# EAGLE design RF08bck (EAGLE 6.6.0)

## Sheet 1 of 2
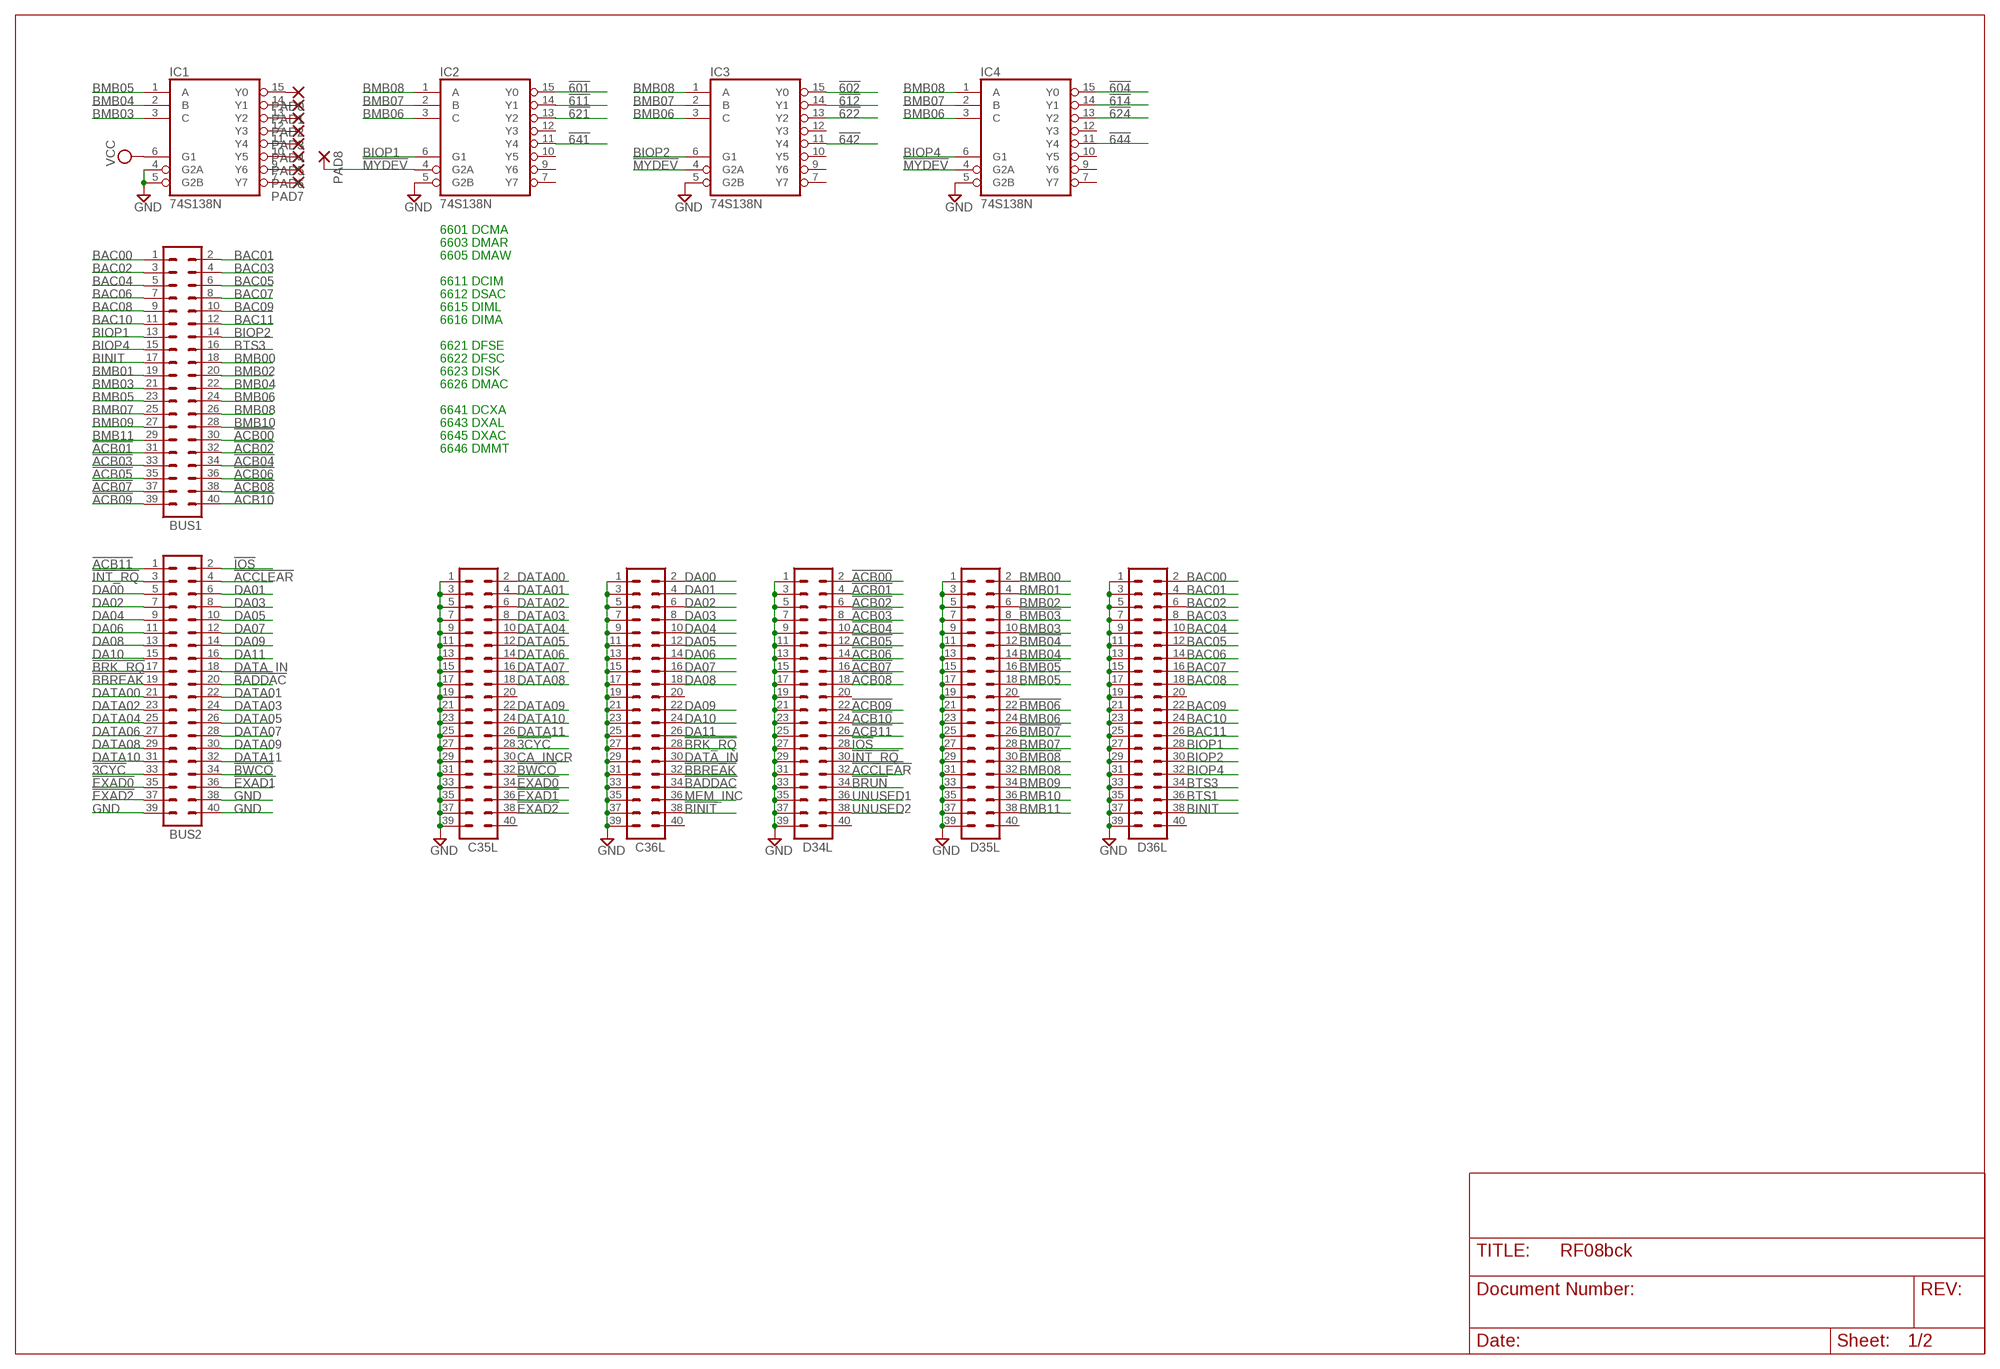
[diagram p0: schematic, sheet 1]

### Parts
BUS1  MA20-2  [MA20-2]
BUS2  MA20-2  [MA20-2]
C35L  MA20-2  [MA20-2]
C36L  MA20-2  [MA20-2]
D34L  MA20-2  [MA20-2]
D35L  MA20-2  [MA20-2]
D36L  MA20-2  [MA20-2]
IC1  74S138N  [DIL16]
IC2  74S138N  [DIL16]
IC3  74S138N  [DIL16]
IC4  74S138N  [DIL16]
PAD0  1,6/0,8  [1,6/0,8]
PAD1  1,6/0,8  [1,6/0,8]
PAD2  1,6/0,8  [1,6/0,8]
PAD3  1,6/0,8  [1,6/0,8]
PAD4  1,6/0,8  [1,6/0,8]
PAD5  1,6/0,8  [1,6/0,8]
PAD6  1,6/0,8  [1,6/0,8]
PAD7  1,6/0,8  [1,6/0,8]
PAD8  1,6/0,8  [1,6/0,8]

### Nets
!3CYC: BUS2.33 C35L.28
!601: IC2.15(Y0) ; also sheet 2
!602: IC3.15(Y0) ; also sheet 2
!604: IC4.15(Y0) ; also sheet 2
!611: IC2.14(Y1)
!612: IC3.14(Y1)
!614: IC4.14(Y1)
!621: IC2.13(Y2)
!622: IC3.13(Y2)
!624: IC4.13(Y2) ; also sheet 2
!641: IC2.11(Y4)
!642: IC3.11(Y4)
!644: IC4.11(Y4)
!ACB00: BUS1.30 D34L.2 ; also sheet 2
!ACB01: BUS1.31 D34L.4 ; also sheet 2
!ACB02: BUS1.32 D34L.6 ; also sheet 2
!ACB03: BUS1.33 D34L.8 ; also sheet 2
!ACB04: BUS1.34 D34L.10 ; also sheet 2
!ACB05: BUS1.35 D34L.12 ; also sheet 2
!ACB06: BUS1.36 D34L.14 ; also sheet 2
!ACB07: BUS1.37 D34L.16 ; also sheet 2
!ACB08: BUS1.38 D34L.18 ; also sheet 2
!ACB09: BUS1.39 D34L.22 ; also sheet 2
!ACB10: BUS1.40 D34L.24 ; also sheet 2
!ACB11: BUS2.1 D34L.26 ; also sheet 2
!ACCLEAR: BUS2.4 D34L.32
!BADDAC: BUS2.20 C36L.34
!BBREAK: BUS2.19 C36L.32
!BINIT: C36L.38
!BMB03: D35L.8
!BMB04: D35L.12
!BMB05: D35L.16
!BMB06: D35L.22
!BMB07: D35L.26
!BMB08: D35L.30
!BRK_RQ: BUS2.17 C36L.28
!BRUN: D34L.34
!BWCO: BUS2.34 C35L.32
!EXAD0: BUS2.35 C35L.34
!EXAD1: BUS2.36 C35L.36
!EXAD2: BUS2.37 C35L.38
!INT_RQ: BUS2.3 D34L.30
!IOS: BUS2.2 D34L.28
!MYDEV: IC2.4(G2A) IC3.4(G2A) IC4.4(G2A) PAD8.1(P)
BAC00: BUS1.1 D36L.2 ; also sheet 2
BAC01: BUS1.2 D36L.4 ; also sheet 2
BAC02: BUS1.3 D36L.6 ; also sheet 2
BAC03: BUS1.4 D36L.8 ; also sheet 2
BAC04: BUS1.5 D36L.10 ; also sheet 2
BAC05: BUS1.6 D36L.12 ; also sheet 2
BAC06: BUS1.7 D36L.14 ; also sheet 2
BAC07: BUS1.8 D36L.16 ; also sheet 2
BAC08: BUS1.9 D36L.18 ; also sheet 2
BAC09: BUS1.10 D36L.22 ; also sheet 2
BAC10: BUS1.11 D36L.24 ; also sheet 2
BAC11: BUS1.12 D36L.26 ; also sheet 2
BINIT: BUS1.17 D36L.38
BIOP1: BUS1.13 D36L.28 IC2.6(G1)
BIOP2: BUS1.14 D36L.30 IC3.6(G1)
BIOP4: BUS1.15 D36L.32 IC4.6(G1)
BMB00: BUS1.18 D35L.2
BMB01: BUS1.19 D35L.4
BMB02: BUS1.20 D35L.6
BMB03: BUS1.21 D35L.10 IC1.3(C)
BMB04: BUS1.22 D35L.14 IC1.2(B)
BMB05: BUS1.23 D35L.18 IC1.1(A)
BMB06: BUS1.24 D35L.24 IC2.3(C) IC3.3(C) IC4.3(C)
BMB07: BUS1.25 D35L.28 IC2.2(B) IC3.2(B) IC4.2(B)
BMB08: BUS1.26 D35L.32 IC2.1(A) IC3.1(A) IC4.1(A)
BMB09: BUS1.27 D35L.34
BMB10: BUS1.28 D35L.36
BMB11: BUS1.29 D35L.38
BTS1: D36L.36
BTS3: BUS1.16 D36L.34
CA_INCR: C35L.30
DA00: BUS2.5 C36L.2
DA01: BUS2.6 C36L.4
DA02: BUS2.7 C36L.6
DA03: BUS2.8 C36L.8
DA04: BUS2.9 C36L.10
DA05: BUS2.10 C36L.12
DA06: BUS2.11 C36L.14
DA07: BUS2.12 C36L.16
DA08: BUS2.13 C36L.18
DA09: BUS2.14 C36L.22
DA10: BUS2.15 C36L.24
DA11: BUS2.16 C36L.26
DATA00: BUS2.21 C35L.2
DATA01: BUS2.22 C35L.4
DATA02: BUS2.23 C35L.6
DATA03: BUS2.24 C35L.8
DATA04: BUS2.25 C35L.10
DATA05: BUS2.26 C35L.12
DATA06: BUS2.27 C35L.14
DATA07: BUS2.28 C35L.16
DATA08: BUS2.29 C35L.18
DATA09: BUS2.30 C35L.22
DATA10: BUS2.31 C35L.24
DATA11: BUS2.32 C35L.26
DATA_IN: BUS2.18 C36L.30
GND: BUS2.38 BUS2.39 BUS2.40 C35L.1 C35L.3 C35L.5 C35L.7 C35L.9 C35L.11 C35L.13 C35L.15 C35L.17 C35L.19 C35L.21 C35L.23 C35L.25 C35L.27 C35L.29 C35L.31 C35L.33 C35L.35 C35L.37 C35L.39 C36L.1 C36L.3 C36L.5 C36L.7 C36L.9 C36L.11 C36L.13 C36L.15 C36L.17 C36L.19 C36L.21 C36L.23 C36L.25 C36L.27 C36L.29 C36L.31 C36L.33 C36L.35 C36L.37 C36L.39 D34L.1 D34L.3 D34L.5 D34L.7 D34L.9 D34L.11 D34L.13 D34L.15 D34L.17 D34L.19 D34L.21 D34L.23 D34L.25 D34L.27 D34L.29 D34L.31 D34L.33 D34L.35 D34L.37 D34L.39 D35L.1 D35L.3 D35L.5 D35L.7 D35L.9 D35L.11 D35L.13 D35L.15 D35L.17 D35L.19 D35L.21 D35L.23 D35L.25 D35L.27 D35L.29 D35L.31 D35L.33 D35L.35 D35L.37 D35L.39 D36L.1 D36L.3 D36L.5 D36L.7 D36L.9 D36L.11 D36L.13 D36L.15 D36L.17 D36L.19 D36L.21 D36L.23 D36L.25 D36L.27 D36L.29 D36L.31 D36L.33 D36L.35 D36L.37 D36L.39 IC1.4(G2A) IC1.5(G2B) IC2.5(G2B) IC3.5(G2B) IC4.5(G2B) ; also sheet 2
MEM_INC: C36L.36
N$1: IC1.9(Y6) PAD6.1(P)
N$5: IC1.15(Y0) PAD0.1(P)
N$6: IC1.14(Y1) PAD1.1(P)
N$7: IC1.13(Y2) PAD2.1(P)
N$8: IC1.12(Y3) PAD3.1(P)
N$9: IC1.11(Y4) PAD4.1(P)
N$10: IC1.10(Y5) PAD5.1(P)
N$11: IC1.7(Y7) PAD7.1(P)
UNUSED1: D34L.36
UNUSED2: D34L.38
VCC: IC1.6(G1)
Unconnected: C35L.20 C35L.40 C36L.20 C36L.40 D34L.20 D34L.40 D35L.20 D35L.40 D36L.20 D36L.40 IC2.7(Y7) IC2.9(Y6) IC2.10(Y5) IC2.12(Y3) IC3.7(Y7) IC3.9(Y6) IC3.10(Y5) IC3.12(Y3) IC4.7(Y7) IC4.9(Y6) IC4.10(Y5) IC4.12(Y3)

### Notes on the sheet
- 6601 DCMA
- 6603 DMAR
- 6605 DMAW
- 6611 DCIM
- 6612 DSAC
- 6615 DIML
- 6616 DIMA
- 6621 DFSE
- 6622 DFSC
- 6623 DISK
- 6626 DMAC
- 6641 DCXA
- 6643 DXAL
- 6645 DXAC
- 6646 DMMT

## Sheet 2 of 2
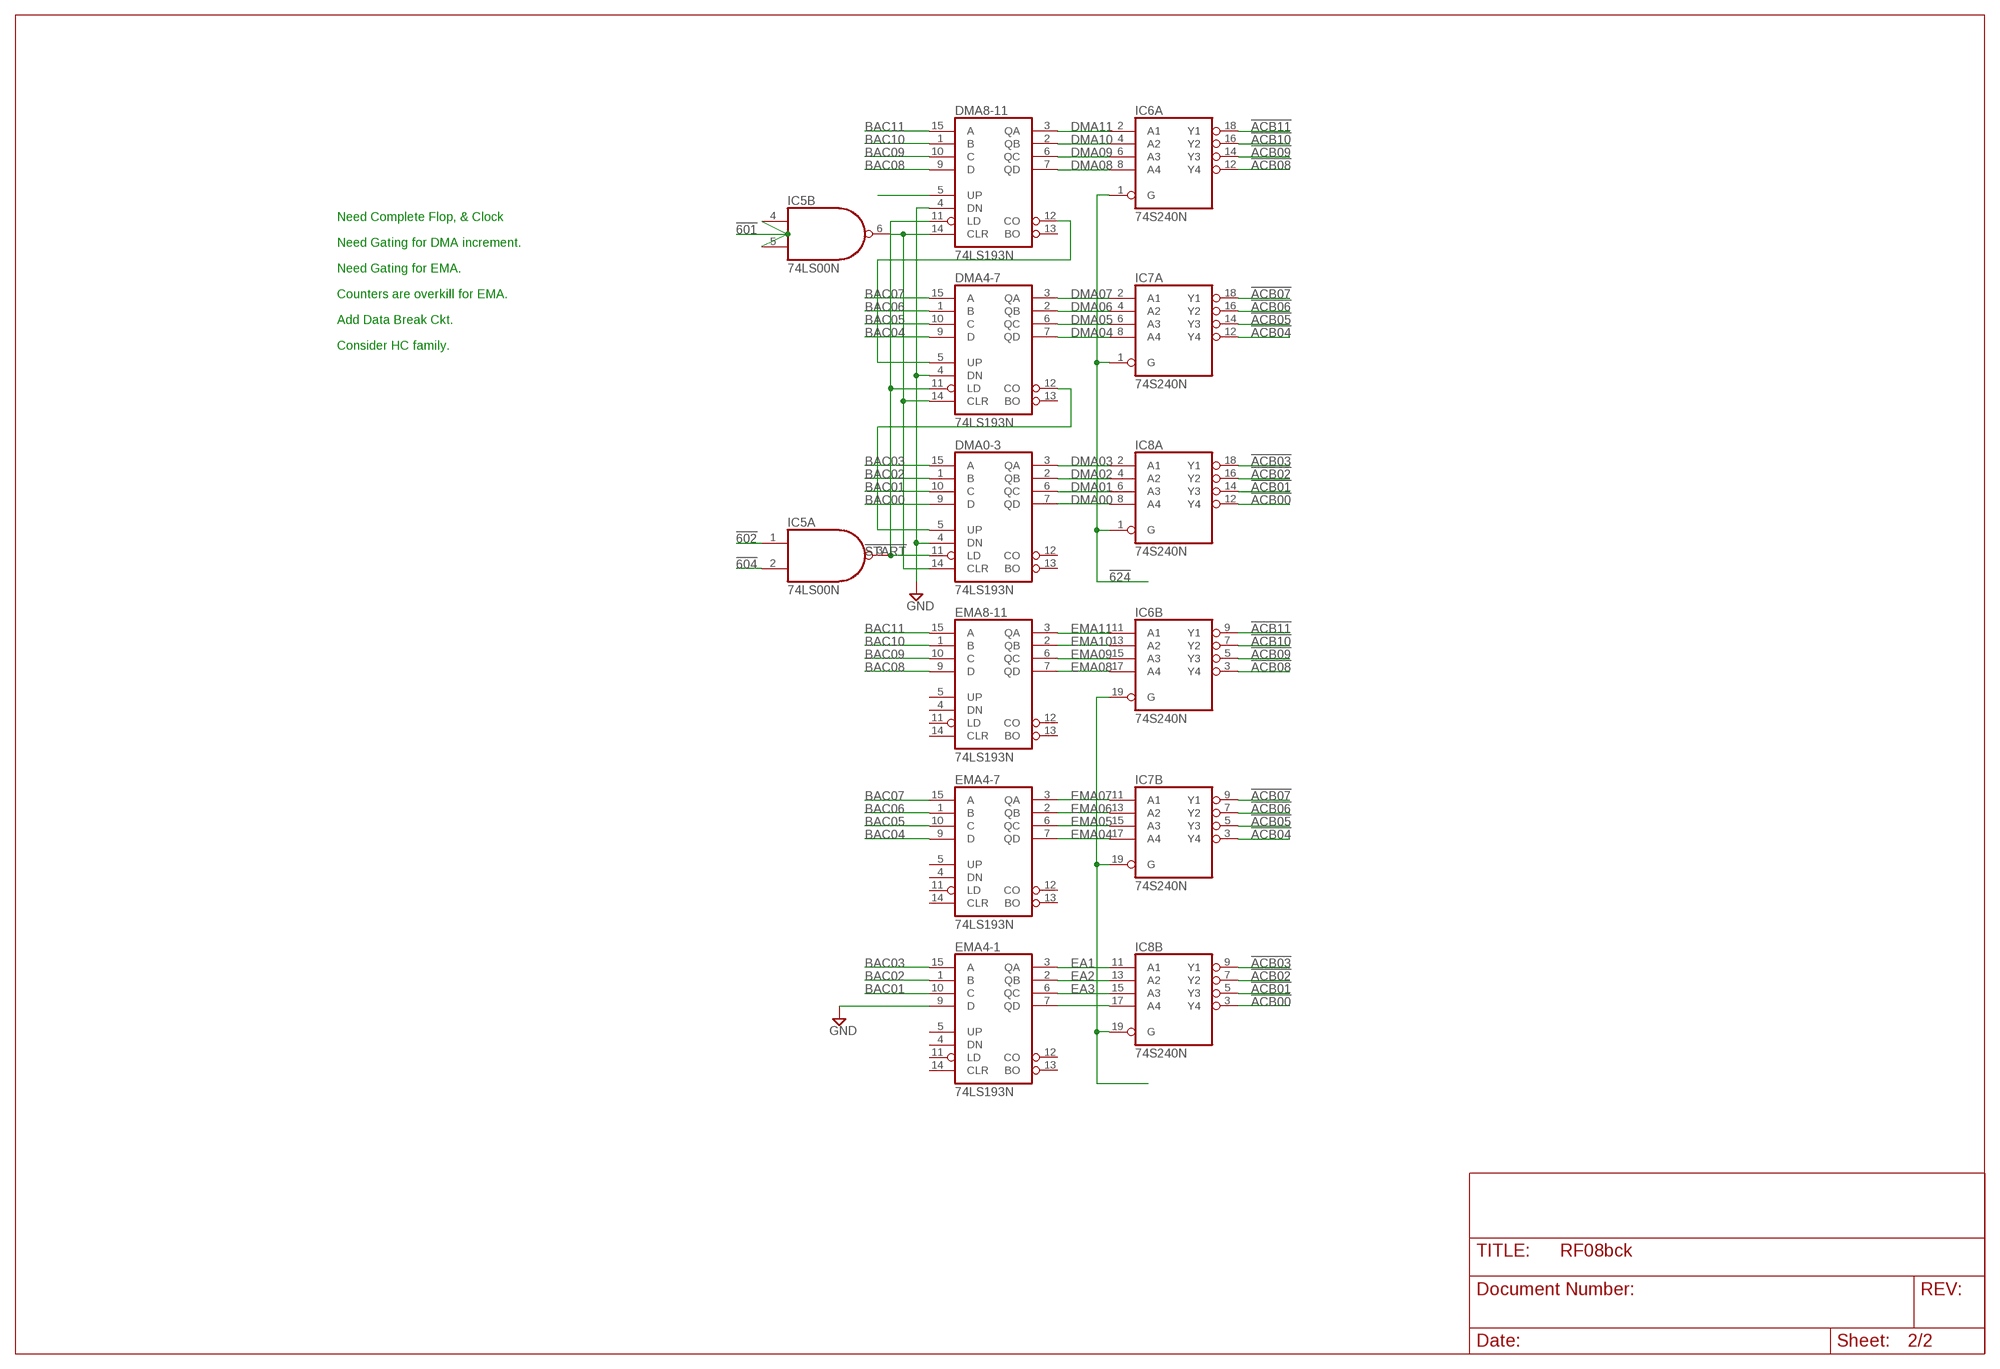
[diagram p1: schematic, sheet 2]

### Parts
DMA0-3  74LS193N  74LS192N  [DIL16]
DMA4-7  74LS193N  74LS192N  [DIL16]
DMA8-11  74LS193N  74LS192N  [DIL16]
EMA4-1  74LS193N  74LS192N  [DIL16]
EMA4-7  74LS193N  74LS192N  [DIL16]
EMA8-11  74LS193N  74LS192N  [DIL16]
IC5  74LS00N  [DIL14]
IC6  74S240N  [DIL20]
IC7  74S240N  [DIL20]
IC8  74S240N  [DIL20]

### Nets
!601: IC5.4(B:I0) IC5.5(B:I1) ; also sheet 1
!602: IC5.1(A:I0) ; also sheet 1
!604: IC5.2(A:I1) ; also sheet 1
!624: IC6.1(A:G) IC7.1(A:G) IC8.1(A:G) ; also sheet 1
!ACB00: IC8.3(B:Y4) IC8.12(A:Y4) ; also sheet 1
!ACB01: IC8.5(B:Y3) IC8.14(A:Y3) ; also sheet 1
!ACB02: IC8.7(B:Y2) IC8.16(A:Y2) ; also sheet 1
!ACB03: IC8.9(B:Y1) IC8.18(A:Y1) ; also sheet 1
!ACB04: IC7.3(B:Y4) IC7.12(A:Y4) ; also sheet 1
!ACB05: IC7.5(B:Y3) IC7.14(A:Y3) ; also sheet 1
!ACB06: IC7.7(B:Y2) IC7.16(A:Y2) ; also sheet 1
!ACB07: IC7.9(B:Y1) IC7.18(A:Y1) ; also sheet 1
!ACB08: IC6.3(B:Y4) IC6.12(A:Y4) ; also sheet 1
!ACB09: IC6.5(B:Y3) IC6.14(A:Y3) ; also sheet 1
!ACB10: IC6.7(B:Y2) IC6.16(A:Y2) ; also sheet 1
!ACB11: IC6.9(B:Y1) IC6.18(A:Y1) ; also sheet 1
!START: DMA0-3.11(LD) DMA4-7.11(LD) DMA8-11.11(LD) IC5.3(A:O)
BAC00: DMA0-3.9(D) ; also sheet 1
BAC01: DMA0-3.10(C) EMA4-1.10(C) ; also sheet 1
BAC02: DMA0-3.1(B) EMA4-1.1(B) ; also sheet 1
BAC03: DMA0-3.15(A) EMA4-1.15(A) ; also sheet 1
BAC04: DMA4-7.9(D) EMA4-7.9(D) ; also sheet 1
BAC05: DMA4-7.10(C) EMA4-7.10(C) ; also sheet 1
BAC06: DMA4-7.1(B) EMA4-7.1(B) ; also sheet 1
BAC07: DMA4-7.15(A) EMA4-7.15(A) ; also sheet 1
BAC08: DMA8-11.9(D) EMA8-11.9(D) ; also sheet 1
BAC09: DMA8-11.10(C) EMA8-11.10(C) ; also sheet 1
BAC10: DMA8-11.1(B) EMA8-11.1(B) ; also sheet 1
BAC11: DMA8-11.15(A) EMA8-11.15(A) ; also sheet 1
DMA00: DMA0-3.7(QD) IC8.8(A:A4)
DMA01: DMA0-3.6(QC) IC8.6(A:A3)
DMA02: DMA0-3.2(QB) IC8.4(A:A2)
DMA03: DMA0-3.3(QA) IC8.2(A:A1)
DMA04: DMA4-7.7(QD) IC7.8(A:A4)
DMA05: DMA4-7.6(QC) IC7.6(A:A3)
DMA06: DMA4-7.2(QB) IC7.4(A:A2)
DMA07: DMA4-7.3(QA) IC7.2(A:A1)
DMA08: DMA8-11.7(QD) IC6.8(A:A4)
DMA09: DMA8-11.6(QC) IC6.6(A:A3)
DMA10: DMA8-11.2(QB) IC6.4(A:A2)
DMA11: DMA8-11.3(QA) IC6.2(A:A1)
EA1: EMA4-1.3(QA) IC8.11(B:A1)
EA2: EMA4-1.2(QB) IC8.13(B:A2)
EA3: EMA4-1.6(QC) IC8.15(B:A3)
EMA04: EMA4-7.7(QD) IC7.17(B:A4)
EMA05: EMA4-7.6(QC) IC7.15(B:A3)
EMA06: EMA4-7.2(QB) IC7.13(B:A2)
EMA07: EMA4-7.3(QA) IC7.11(B:A1)
EMA08: EMA8-11.7(QD) IC6.17(B:A4)
EMA09: EMA8-11.6(QC) IC6.15(B:A3)
EMA10: EMA8-11.2(QB) IC6.13(B:A2)
EMA11: EMA8-11.3(QA) IC6.11(B:A1)
GND: DMA0-3.4(DN) DMA4-7.4(DN) DMA8-11.4(DN) EMA4-1.9(D) ; also sheet 1
N$3: DMA0-3.5(UP) DMA4-7.12(CO)
N$4: DMA8-11.5(UP)
N$12: EMA4-1.7(QD) IC8.17(B:A4)
N$13: DMA4-7.5(UP) DMA8-11.12(CO)
N$16: IC6.19(B:G) IC7.19(B:G) IC8.19(B:G)
N$22: DMA0-3.14(CLR) DMA4-7.14(CLR) DMA8-11.14(CLR) IC5.6(B:O)
Unconnected: DMA0-3.12(CO) DMA0-3.13(BO) DMA4-7.13(BO) DMA8-11.13(BO) EMA4-1.4(DN) EMA4-1.5(UP) EMA4-1.11(LD) EMA4-1.12(CO) EMA4-1.13(BO) EMA4-1.14(CLR) EMA4-7.4(DN) EMA4-7.5(UP) EMA4-7.11(LD) EMA4-7.12(CO) EMA4-7.13(BO) EMA4-7.14(CLR) EMA8-11.4(DN) EMA8-11.5(UP) EMA8-11.11(LD) EMA8-11.12(CO) EMA8-11.13(BO) EMA8-11.14(CLR) IC5.8(C:O) IC5.9(C:I0) IC5.10(C:I1) IC5.11(D:O) IC5.12(D:I0) IC5.13(D:I1)

### Notes on the sheet
- Need Complete Flop, & Clock
- Need Gating for DMA increment.
- Need Gating for EMA.
- Counters are overkill for EMA.
- Add Data Break Ckt.
- Consider HC family.

## Power pins joined to a net without a drawn wire
GND: DMA0-3.8(GND) DMA4-7.8(GND) DMA8-11.8(GND) EMA4-1.8(GND) EMA4-7.8(GND) EMA8-11.8(GND) IC1.8(GND) IC2.8(GND) IC3.8(GND) IC4.8(GND) IC5.7(P:GND) IC6.10(P:GND) IC7.10(P:GND) IC8.10(P:GND)
VCC: DMA0-3.16(VCC) DMA4-7.16(VCC) DMA8-11.16(VCC) EMA4-1.16(VCC) EMA4-7.16(VCC) EMA8-11.16(VCC) IC1.16(VCC) IC2.16(VCC) IC3.16(VCC) IC4.16(VCC) IC5.14(P:VCC) IC6.20(P:VCC) IC7.20(P:VCC) IC8.20(P:VCC)

## Library data of the parts
BUS1 BUS2 C35L C36L D34L D35L D36L = con-lstb:MA20-2: PIN HEADER; OC_FARNELL: unknown; OC_NEWARK: unknown
DMA0-3 DMA4-7 DMA8-11 EMA4-1 EMA4-7 EMA8-11 = 74xx-us:74*192: Synchronous 4-bit UP/DOWN COUNTER
IC1-IC4 = 74xx-us:74*138: 3-line to 8-line DECODER/DEMULTIPLEXER
IC5 = 74xx-us:74*00: Quad 2-input NAND gate
IC6-IC8 = 74xx-us:74*240: Octal BUFFER and LINE DRIVER, 3-state
PAD0 PAD1-PAD8 = wirepad:1,6/0,8: THROUGH-HOLE PAD

## Board
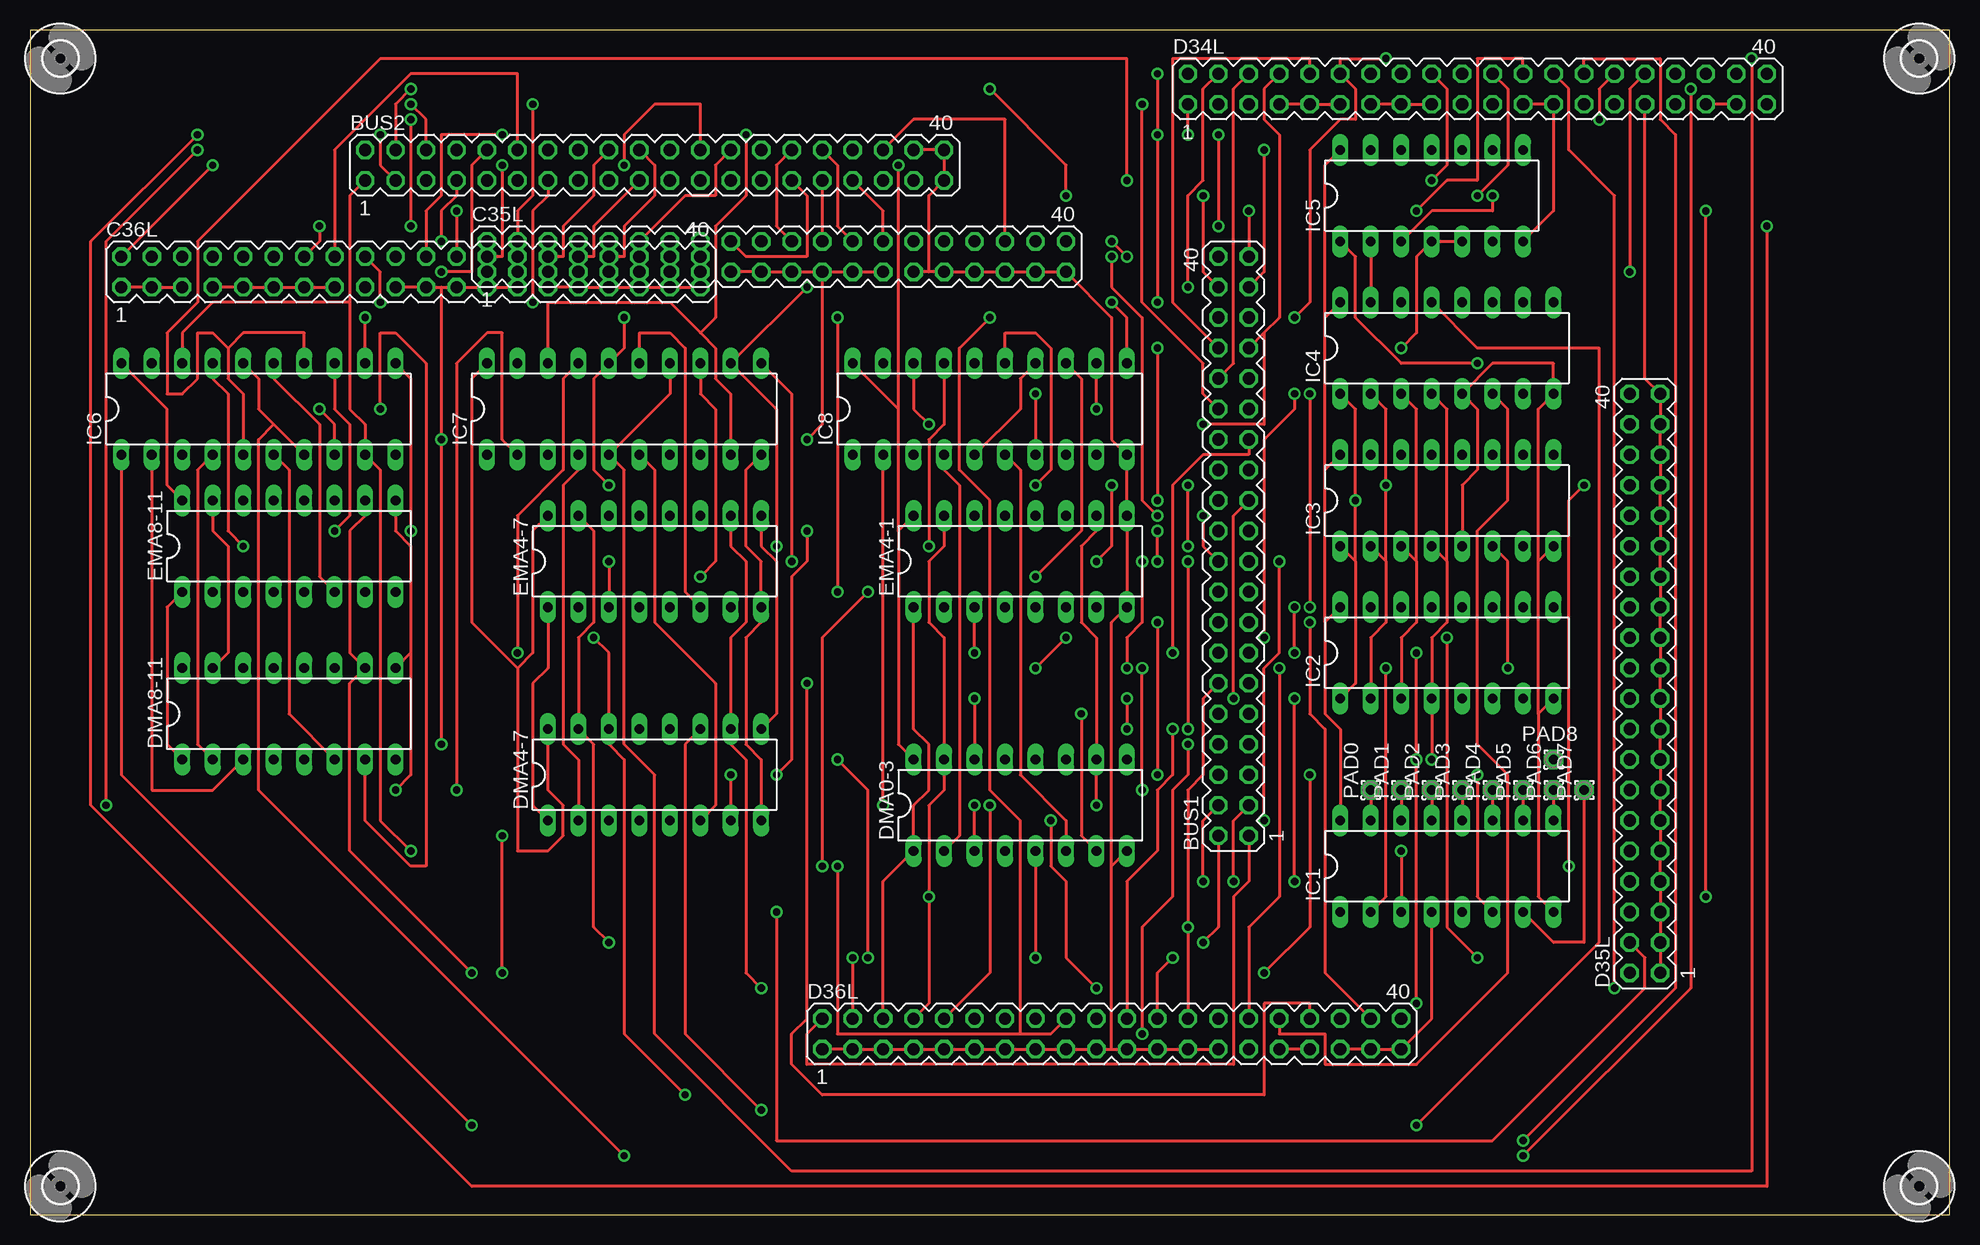
[diagram p2: board, top side]
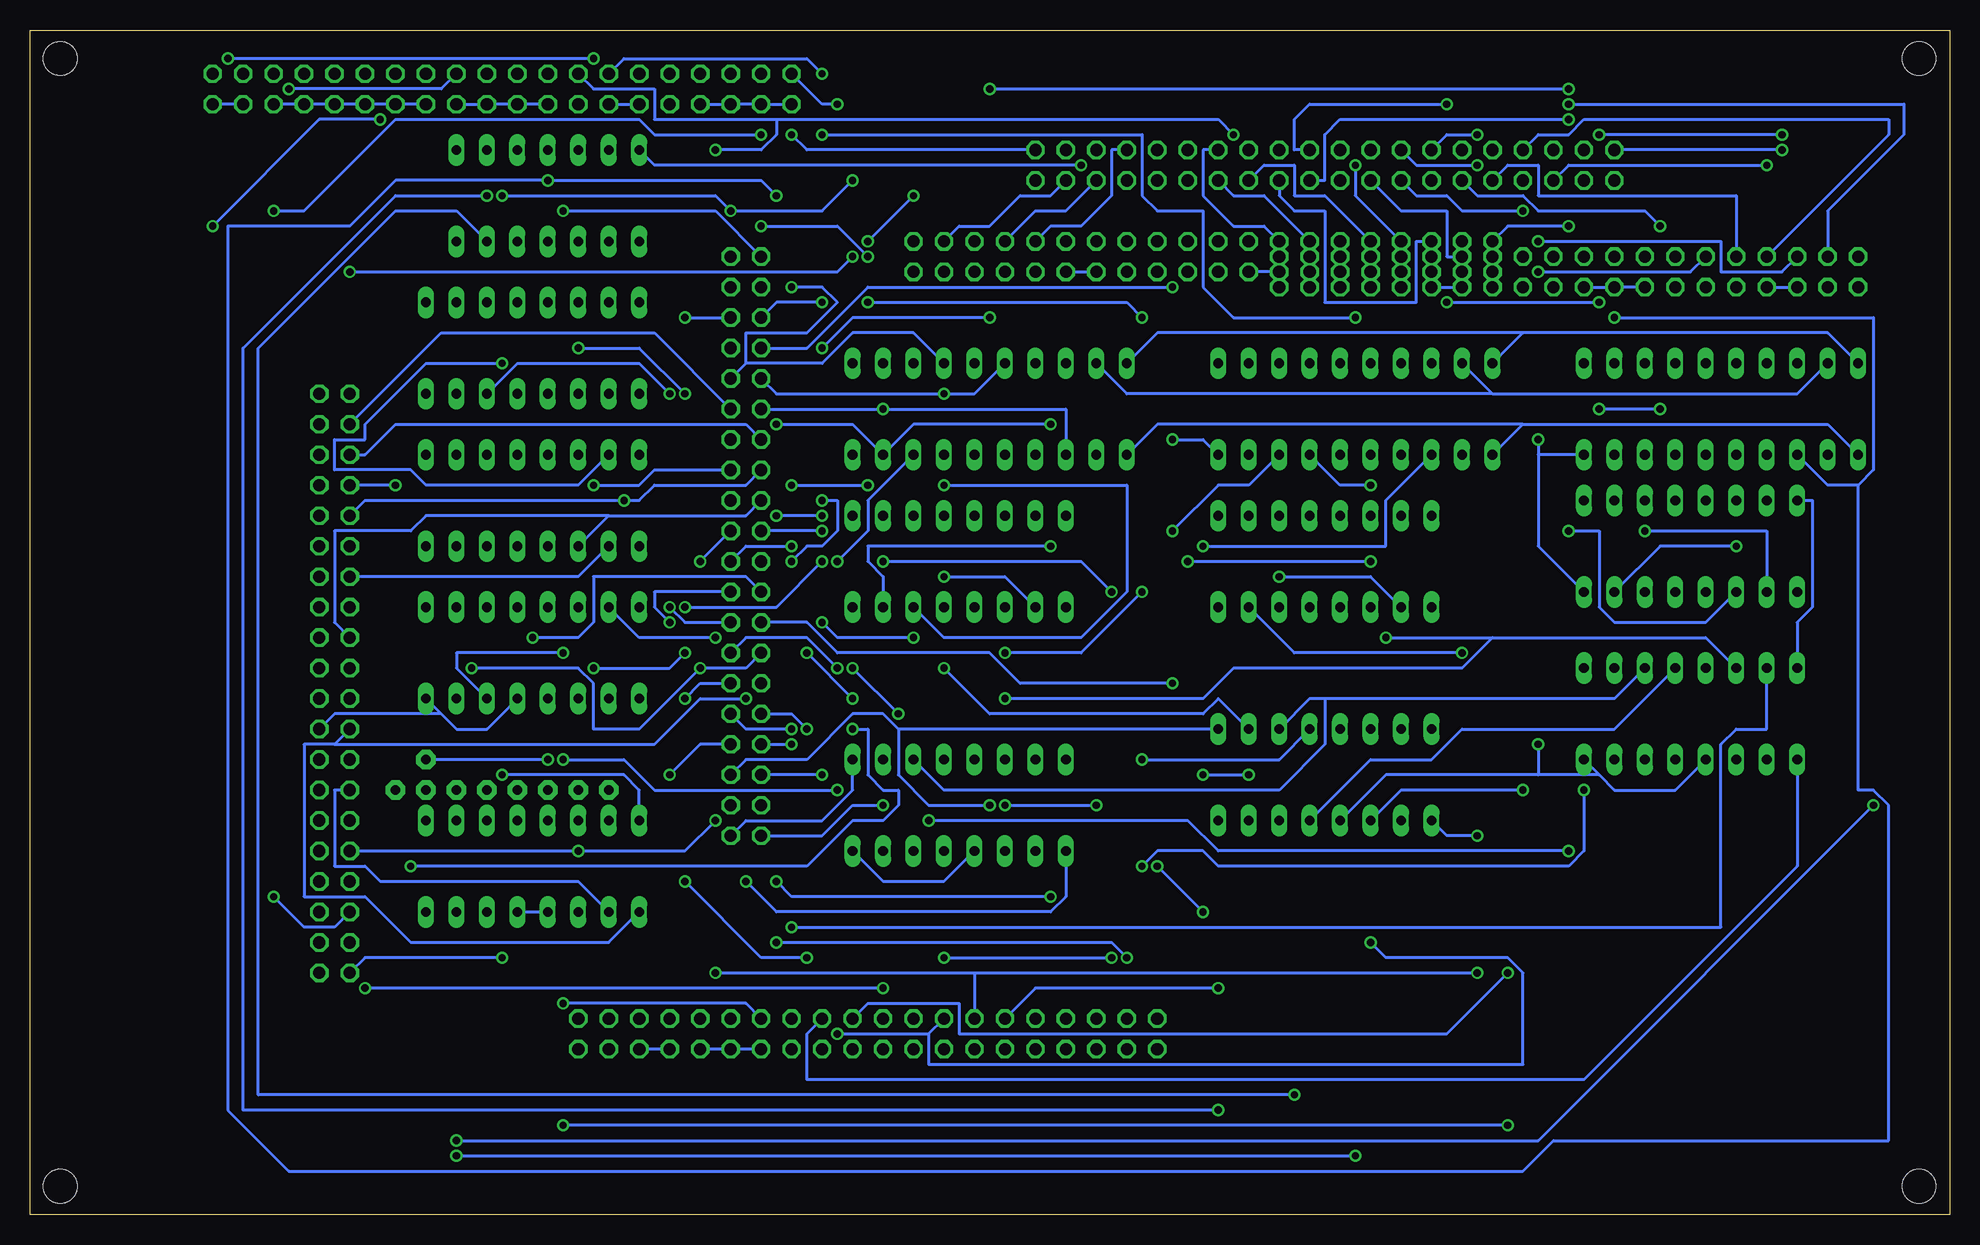
[diagram p3: board, bottom side, seen from below]

Size 160 x 98.73 mm. Coordinates in mm from the lower left corner, seen from the top.
Outline: 0,0 160,0 160,98.73 0,98.73 0,0
Copper layers (1*16): Top 0.035mm / dielectric 1.5mm / Bottom 0.035mm
Design rules "default": minimum track width 10mil, minimum drill 24mil, track to track 8mil, track to pad 8mil, pad to pad 8mil, via to via 8mil, smd to smd 8mil, copper to edge 40mil, drill to drill 8mil, minimum pad ring 10mil, minimum via ring 8mil, stop-mask expansion 4mil, vias tented up to drill 0mil, thermal gap 10mil

### Footprints (pad centres in the part's own frame; a part is rotated, then mirrored left to right if it is on the bottom)
MA20-2 = drill 1.016 octagon: 1 -24.13,-1.27; 2 -24.13,1.27; 3 -21.59,-1.27; 4 -21.59,1.27; 5 -19.05,-1.27; 6 -19.05,1.27; 7 -16.51,-1.27; 8 -16.51,1.27; 9 -13.97,-1.27; 10 -13.97,1.27; 11 -11.43,-1.27; 12 -11.43,1.27; 13 -8.89,-1.27; 14 -8.89,1.27; 15 -6.35,-1.27; 16 -6.35,1.27; 17 -3.81,-1.27; 18 -3.81,1.27; 19 -1.27,-1.27; 20 -1.27,1.27; 21 1.27,-1.27; 22 1.27,1.27; 23 3.81,-1.27; 24 3.81,1.27; 25 6.35,-1.27; 26 6.35,1.27; 27 8.89,-1.27; 28 8.89,1.27; 29 11.43,-1.27; 30 11.43,1.27; 31 13.97,-1.27; 32 13.97,1.27; 33 16.51,-1.27; 34 16.51,1.27; 35 19.05,-1.27; 36 19.05,1.27; 37 21.59,-1.27; 38 21.59,1.27; 39 24.13,-1.27; 40 24.13,1.27
DIL16 = drill 0.813 long: 1 -8.89,-3.81; 2 -6.35,-3.81; 3 -3.81,-3.81; 4 -1.27,-3.81; 5 1.27,-3.81; 6 3.81,-3.81; 7 6.35,-3.81; 8 8.89,-3.81; 9 8.89,3.81; 10 6.35,3.81; 11 3.81,3.81; 12 1.27,3.81; 13 -1.27,3.81; 14 -3.81,3.81; 15 -6.35,3.81; 16 -8.89,3.81
DIL14 = drill 0.813 long: 1 -7.62,-3.81; 2 -5.08,-3.81; 3 -2.54,-3.81; 4 0,-3.81; 5 2.54,-3.81; 6 5.08,-3.81; 7 7.62,-3.81; 8 7.62,3.81; 9 5.08,3.81; 10 2.54,3.81; 11 0,3.81; 12 -2.54,3.81; 13 -5.08,3.81; 14 -7.62,3.81
DIL20 = drill 0.813 long: 1 -11.43,-3.81; 2 -8.89,-3.81; 3 -6.35,-3.81; 4 -3.81,-3.81; 5 -1.27,-3.81; 6 1.27,-3.81; 7 3.81,-3.81; 8 6.35,-3.81; 9 8.89,-3.81; 10 11.43,-3.81; 11 11.43,3.81; 12 8.89,3.81; 13 6.35,3.81; 14 3.81,3.81; 15 1.27,3.81; 16 -1.27,3.81; 17 -3.81,3.81; 18 -6.35,3.81; 19 -8.89,3.81; 20 -11.43,3.81
1,6/0,8 = drill 0.813 pad 1.6 octagon: 1 0,0
2,8 = hole 2.8: 0,0

### Placement (x,y rotation side)
BUS1  100.33,55.72 90 top
BUS2  52.06,87.46 0 top
C35L  62.22,79.84 0 top
C36L  31.75,78.57 0 top
D34L  120.65,93.81 0 top
D35L  134.62,44.29 90 top
D36L  90.17,15.08 0 top
DMA0-3  82.55,34.12 0 top
DMA4-7  52.06,36.66 0 top
DMA8-11  21.59,41.74 0 top
EMA4-1  82.55,54.45 0 top
EMA4-7  52.06,54.45 0 top
EMA8-11  21.59,55.72 0 top
IC1  118.11,29.05 0 top
IC2  118.11,46.83 0 top
IC3  118.11,59.52 0 top
IC4  118.11,72.22 0 top
IC5  116.84,84.92 0 top
IC6  19.05,67.14 0 top
IC7  49.52,67.14 0 top
IC8  80.01,67.14 0 top
PAD0  111.76,35.4 90 top
PAD1  114.3,35.4 90 top
PAD2  116.84,35.4 90 top
PAD3  119.38,35.4 90 top
PAD4  121.92,35.4 90 top
PAD5  124.45,35.4 90 top
PAD6  127,35.4 90 top
PAD7  129.53,35.4 90 top
PAD8  127,37.94 90 top
U$1  [2,8]  157.47,96.35 0 top
U$2  [2,8]  2.54,96.35 0 top
U$3  [2,8]  2.54,2.38 0 top
U$4  [2,8]  157.47,2.38 0 top

### Tracks (layer width: path | path; a pad name or v marks a point on that pad's centre or on a via)
!3CYC
  Top 0.254: BUS2.33 71.12,83.65 C35L.28
!601  (via drill 0.61)
  Top 0.254: v102.87,48.09 102.87,64.6 105.41,67.14 v105.41,68.41 | v114.3,72.22 115.56,73.49 115.56,79.84 IC5.4 IC5.5
  Bottom 0.254: IC2.15 109.22,48.09 v102.87,48.09 | v105.41,68.41 109.22,72.22 v114.3,72.22
!602  (via drill 0.61)
  Top 0.254: IC5.1 110.48,79.84 110.48,74.77 114.3,70.95 v120.65,70.95
  Bottom 0.254: v120.65,70.95 127,70.95 132.08,65.88 132.08,64.6 134.62,64.6 134.62,62.06 128.27,62.06 127,60.8 114.3,60.8 IC3.15
!604
  Top 0.254: IC5.2 IC4.15
!624  (via drill 0.61)
  Top 0.254: IC4.13 120.65,72.22 130.81,72.22 130.81,22.7 v115.56,7.46 | v36.82,7.46 7.62,36.66 IC6.1
  Bottom 0.254: IC6.1 10.15,65.88 35.55,65.88 | IC7.1 35.55,65.88 | IC8.1 66.04,65.88 35.55,65.88 | v36.82,7.46 v115.56,7.46
!ACB00  (via drill 0.61)
  Top 0.254: v88.9,67.14 IC8.12 | v92.7,92.54 92.7,76.03 97.79,70.95 97.79,68.41 BUS1.30
  Bottom 0.254: IC8.3 73.66,67.14 v88.9,67.14 BUS1.30 | D34L.2 93.98,92.54 v92.7,92.54
!ACB01  (via drill 0.61)
  Top 0.254: IC8.5 82.55,67.14 82.55,69.68 IC8.14 | D34L.4 97.79,93.81 97.79,86.19 96.52,84.92 v96.52,77.3
  Bottom 0.254: 100.33,70.95 BUS1.31 | 100.33,70.95 93.98,70.95 91.44,73.49 86.36,73.49 IC8.14 | v96.52,77.3 93.98,77.3 92.7,76.03 95.25,73.49 100.33,73.49 100.33,70.95
!ACB02  (via drill 0.61)
  Top 0.254: v83.81,68.41 IC8.7 | D34L.6 100.33,93.81 100.33,70.95 BUS1.32
  Bottom 0.254: IC8.16 81.28,68.41 v83.81,68.41 97.79,68.41 BUS1.32
!ACB03  (via drill 0.61)
  Top 0.254: v74.93,65.88 73.66,67.14 IC8.18 | 102.87,73.49 104.14,74.77 104.14,90 102.87,91.27 102.87,93.81 D34L.8 | 102.87,73.49 BUS1.33 | v97.79,65.88 102.87,65.88 102.87,73.49
  Bottom 0.254: v74.93,65.88 86.36,65.88 IC8.9 91.44,65.88 v97.79,65.88
!ACB04  (via drill 0.61)
  Top 0.254: v62.22,55.72 62.22,67.14 IC7.12 v64.77,77.3 | BUS1.34 95.25,76.03 95.25,96.35 106.68,96.35 D34L.10
  Bottom 0.254: IC7.3 46.98,59.52 46.98,55.72 v62.22,55.72 | v64.77,77.3 90.17,77.3 95.25,72.22 BUS1.34
!ACB05  (via drill 0.61)
  Top 0.254: IC7.14 53.34,68.41 IC7.5 49.52,62.06 49.52,39.2 52.06,36.66 52.06,15.08 63.49,3.65 143.5,3.65 v143.5,96.35 | v105.41,74.77 106.68,76.03 106.68,88.73 109.22,91.27 110.48,91.27 110.48,93.81 D34L.12 109.22,96.35 v113.03,96.35
  Bottom 0.254: v105.41,74.77 BUS1.35 | v113.03,96.35 v143.5,96.35
!ACB06  (via drill 0.61)
  Top 0.254: v48.25,60.8 46.98,62.06 46.98,69.68 IC7.16 49.52,72.22 v49.52,74.77 | v93.98,95.08 v93.98,90 v93.98,76.03
  Bottom 0.254: IC7.7 50.79,60.8 v48.25,60.8 | BUS1.36 97.79,76.03 v93.98,76.03 | v93.98,95.08 95.25,96.35 110.48,96.35 D34L.14 | v49.52,74.77 59.68,74.77 62.22,77.3 62.22,83.65 66.04,83.65 67.31,84.92 67.31,90 v93.98,90
!ACB07  (via drill 0.61)
  Top 0.254: IC7.9 58.41,68.41 57.14,69.68 57.14,72.22 55.88,73.49 | 55.88,73.49 53.34,76.03 43.17,76.03 IC7.18 | BUS1.37 102.87,78.57 v102.87,88.73 | 55.88,73.49 57.14,74.77 57.14,82.38 59.68,84.92 v59.68,90
  Bottom 0.254: v102.87,88.73 99.06,88.73 97.79,90 97.79,91.27 | 97.79,91.27 107.95,91.27 107.95,93.81 113.03,93.81 D34L.16 | v59.68,90 60.95,91.27 97.79,91.27
!ACB08  (via drill 0.61)
  Top 0.254: IC6.12 v27.94,74.77 | BUS1.38 97.79,78.57 v97.79,84.92 | v116.84,86.19 118.11,87.46 118.11,93.81 D34L.18
  Bottom 0.254: IC6.3 10.15,60.8 7.62,60.8 | 7.62,60.8 6.34,62.06 6.34,74.77 v27.94,74.77 | v97.79,84.92 99.06,86.19 v116.84,86.19 129.53,86.19 133.34,82.38 143.5,82.38 143.5,8.73 138.43,3.65 35.55,3.65 33.02,6.18 5.08,6.18 5.08,34.12 6.34,35.4 7.62,35.4 7.62,60.8
!ACB09  (via drill 0.61)
  Top 0.254: IC6.5 17.78,68.41 16.51,69.68 16.51,72.22 | 16.51,72.22 17.78,73.49 22.86,73.49 IC6.14 | v101.59,83.65 BUS1.39 | v120.65,84.92 123.19,87.46 123.19,93.81 D34L.22 | 16.51,72.22 15.23,73.49 13.96,73.49 13.96,69.68 12.69,68.41 11.42,68.41 11.42,73.49 13.96,76.03 13.96,81.11 29.21,96.35 91.44,96.35 v91.44,86.19
  Bottom 0.254: v120.65,84.92 102.87,84.92 v101.59,83.65 93.98,83.65 v91.44,86.19
!ACB10  (via drill 0.61)
  Top 0.254: 20.32,65.88 19.05,67.14 19.05,69.68 IC6.16 | 20.32,65.88 IC6.7 | v115.56,83.65 118.11,86.19 120.65,86.19 120.65,96.35 124.45,96.35 D34L.24 | 20.32,65.88 19.05,64.6 19.05,35.4 v49.52,4.92 | v124.45,4.92 138.43,18.89 v138.43,93.81
  Bottom 0.254: BUS1.40 102.87,83.65 v115.56,83.65 | v124.45,4.92 v49.52,4.92 | v138.43,93.81 125.73,93.81 D34L.24
!ACB11  (via drill 0.61)
  Top 0.254: IC6.18 12.69,73.49 15.23,76.03 26.67,76.03 | 26.67,76.03 26.67,84.92 BUS2.1 | 26.67,76.03 26.67,67.14 27.94,65.88 IC6.9 29.21,62.06 29.21,32.86 v31.75,30.32 | D34L.26 128.27,93.81 128.27,88.73 132.08,84.92 v132.08,18.89 | v88.9,18.89 86.36,21.43 86.36,27.78 85.09,29.05 v85.09,32.86
  Bottom 0.254: v88.9,18.89 v132.08,18.89 | v85.09,32.86 63.49,32.86 60.95,30.32 v31.75,30.32
!ACCLEAR  (via drill 0.61)
  Top 0.254: BUS2.4 30.48,92.54 v31.75,93.81 | v80.01,93.81 86.36,87.46 v86.36,84.92 | v91.44,79.84 v90.17,81.11 | v133.34,78.57 133.34,93.81 D34L.32
  Bottom 0.254: v80.01,93.81 v31.75,93.81 | v90.17,81.11 v86.36,84.92 | v91.44,79.84 92.7,78.57 v133.34,78.57
!BADDAC
  Top 0.254: C36L.34 49.52,79.84 49.52,82.38 52.06,84.92 52.06,87.46 BUS2.20
!BBREAK
  Top 0.254: C36L.32 46.98,79.84 46.98,82.38 BUS2.19
!BRK_RQ
  Bottom 0.254: C36L.28 41.9,79.84 41.9,83.65 45.71,83.65 BUS2.17
!BWCO
  Bottom 0.254: C35L.32 74.93,82.38 72.39,82.38 69.84,84.92 69.84,88.73 BUS2.34
!EXAD0
  Bottom 0.254: BUS2.35 73.66,83.65 76.2,83.65 C35L.34
!EXAD1
  Top 0.254: BUS2.36 73.66,91.27 81.28,91.27 C35L.36
!EXAD2
  Bottom 0.254: BUS2.37 74.93,84.92 77.47,84.92 80.01,82.38 82.55,82.38 C35L.38
!INT_RQ  (via drill 0.61)
  Top 0.254: BUS2.3 29.21,87.46 v29.21,90 | v13.96,90 5.08,81.11 5.08,34.12 36.82,2.38 144.78,2.38 v144.78,82.38 | v130.81,91.27 130.81,93.81 D34L.30
  Bottom 0.254: v13.96,90 v29.21,90 | v144.78,82.38 135.88,91.27 v130.81,91.27
!IOS  (via drill 0.61)
  Top 0.254: v13.96,88.73 6.34,81.11 v6.34,34.12 | v124.45,6.18 137.16,18.89 137.16,90 135.88,91.27 135.88,96.35 129.53,96.35 D34L.28
  Bottom 0.254: v13.96,88.73 BUS2.2 | v6.34,34.12 34.28,6.18 v124.45,6.18
!MYDEV  (via drill 0.61)
  Top 0.254: 118.11,54.45 118.11,49.37 116.84,48.09 IC2.4 v116.84,37.94 | IC3.4 118.11,54.45 | IC4.4 118.11,67.14 118.11,54.45
  Bottom 0.254: v116.84,37.94 PAD8.1
!START  (via drill 0.61)
  Top 0.254: IC5.3 116.84,83.65 121.92,83.65 v121.92,84.92 | v60.95,8.73 54.6,15.08 54.6,39.2 DMA4-7.11
  Bottom 0.254: DMA4-7.11 53.34,43.02 52.06,43.02 | 52.06,43.02 27.94,43.02 DMA8-11.11 | DMA0-3.11 83.81,35.4 55.88,35.4 52.06,39.2 52.06,43.02 | v121.92,84.92 129.53,84.92 142.24,72.22 142.24,8.73 v60.95,8.73
BAC00
  Top 0.254: D36L.2 64.77,15.08 64.77,12.54 100.33,12.54 100.33,26.51 101.59,27.78 BUS1.1
  Bottom 0.254: DMA0-3.9 91.44,35.4 93.98,32.86 100.33,32.86 BUS1.1
BAC01  (via drill 0.61)
  Top 0.254: EMA4-1.10 88.9,56.98 87.62,55.72 87.62,49.37 88.9,48.09 DMA0-3.10 v88.9,34.12 | v68.58,21.43 D36L.4 | v97.79,22.7 99.06,23.96 BUS1.2
  Bottom 0.254: v68.58,21.43 69.84,22.7 v97.79,22.7 | v88.9,34.12 91.44,34.12 93.98,31.59 BUS1.2
BAC02  (via drill 0.61)
  Top 0.254: D36L.6 71.12,27.78 DMA0-3.1 73.66,34.12 74.93,35.4 74.93,39.2 73.66,40.48 EMA4-1.1 | BUS1.3 100.33,32.86 v100.33,27.78
  Bottom 0.254: v100.33,27.78 97.79,25.23 74.93,25.23 73.66,26.51 DMA0-3.1
BAC03  (via drill 0.61)
  Top 0.254: EMA4-1.15 76.2,55.72 74.93,54.45 74.93,49.37 76.2,48.09 DMA0-3.15 76.2,35.4 74.93,34.12 v74.93,26.51 74.93,17.62 D36L.8 | BUS1.4 97.79,32.86 v97.79,27.78
  Bottom 0.254: v97.79,27.78 96.52,26.51 v74.93,26.51
BAC04  (via drill 0.61)
  Top 0.254: DMA4-7.9 62.22,41.74 62.22,54.45 60.95,55.72 EMA4-7.9 | D36L.10 80.01,20.16 v80.01,34.12
  Bottom 0.254: v80.01,34.12 85.09,34.12 87.62,36.66 87.62,40.48 | DMA4-7.9 87.62,40.48 | BUS1.5 100.33,37.94 95.25,37.94 91.44,41.74 88.9,41.74 87.62,40.48
BAC05  (via drill 0.61)
  Top 0.254: EMA4-7.10 58.41,55.72 59.68,54.45 59.68,49.37 58.41,48.09 DMA4-7.10 58.41,39.2 59.68,37.94 59.68,20.16 v60.95,18.89 | v93.98,49.37 v93.98,36.66 | v83.81,45.55 v86.36,48.09
  Bottom 0.254: D36L.12 76.2,18.89 v60.95,18.89 | v93.98,36.66 BUS1.6 | v93.98,49.37 92.7,48.09 v86.36,48.09 | v83.81,45.55 80.01,41.74 62.22,41.74 60.95,43.02 DMA4-7.10
BAC06  (via drill 0.61)
  Top 0.254: DMA4-7.1 41.9,34.12 41.9,44.29 43.17,45.55 EMA4-7.1 | v102.87,20.16 106.68,23.96 v106.68,36.66 | v39.36,20.16 v39.36,31.59
  Bottom 0.254: 81.28,20.16 D36L.14 | v102.87,20.16 81.28,20.16 | v106.68,36.66 104.14,39.2 BUS1.7 | DMA4-7.1 41.9,31.59 v39.36,31.59 | 81.28,20.16 v39.36,20.16
BAC07  (via drill 0.61)
  Top 0.254: EMA4-7.15 46.98,56.98 46.98,49.37 45.71,48.09 DMA4-7.15 46.98,39.2 46.98,23.96 v48.25,22.7 | v92.7,15.08 92.7,23.96 95.25,26.51 95.25,35.4 96.52,36.66 v96.52,39.2
  Bottom 0.254: 85.09,15.08 D36L.16 | v92.7,15.08 85.09,15.08 | BUS1.8 v96.52,39.2 | v48.25,22.7 46.98,21.43 36.82,21.43 35.55,20.16 35.55,12.54 85.09,12.54 85.09,15.08
BAC08  (via drill 0.61)
  Top 0.254: 31.75,46.83 DMA8-11.9 | 31.75,46.83 31.75,55.72 30.48,56.98 EMA8-11.9 | D36L.18 85.09,15.08 82.55,15.08 | 82.55,15.08 67.31,15.08 v67.31,29.05 | v30.48,35.4 31.75,36.66 31.75,46.83 | v96.52,54.45 v96.52,40.48 | v93.98,72.22 v93.98,59.52 | v80.01,74.77 77.47,72.22 77.47,62.06 80.01,59.52 80.01,35.4 82.55,32.86 82.55,15.08
  Bottom 0.254: v67.31,29.05 66.04,30.32 62.22,30.32 60.95,29.05 31.75,29.05 30.48,30.32 v30.48,35.4 | BUS1.9 100.33,40.48 v96.52,40.48 | v96.52,54.45 95.25,55.72 93.98,55.72 92.7,56.98 92.7,59.52 v93.98,59.52 | v93.98,72.22 91.44,74.77 v80.01,74.77
BAC09  (via drill 0.61)
  Top 0.254: EMA8-11.10 27.94,58.26 26.67,56.98 26.67,46.83 DMA8-11.10 26.67,44.29 26.67,30.32 v36.82,20.16 | D36L.22 91.44,27.78 93.98,30.32 93.98,35.4 95.25,36.66 v95.25,40.48
  Bottom 0.254: v95.25,40.48 96.52,41.74 BUS1.10 | v36.82,20.16 41.9,15.08 82.55,15.08 82.55,17.62 90.17,17.62 D36L.22
BAC10  (via drill 0.61)
  Top 0.254: DMA8-11.1 11.42,39.2 11.42,50.63 EMA8-11.1 | v105.41,27.78 v105.41,43.02 | v95.25,21.43 93.98,20.16 D36L.24
  Bottom 0.254: D36L.24 95.25,15.08 95.25,11.27 30.48,11.27 12.69,29.05 DMA8-11.1 | BUS1.11 104.14,44.29 v105.41,43.02 | v105.41,27.78 99.06,21.43 v95.25,21.43
BAC11  (via drill 0.61)
  Top 0.254: DMA8-11.15 16.51,46.83 16.51,55.72 15.23,56.98 EMA8-11.15 | D36L.26 v96.52,23.96 96.52,35.4 97.79,36.66 97.79,43.02 BUS1.12
  Bottom 0.254: DMA8-11.15 15.23,40.48 17.78,40.48 19.05,39.2 19.05,23.96 v96.52,23.96
BINIT  (via drill 0.61)
  Top 0.254: D36L.38 107.95,20.16 107.95,40.48 106.68,41.74 v106.68,49.37
  Bottom 0.254: v106.68,49.37 107.95,50.63 107.95,51.91 BUS1.17
BIOP1  (via drill 0.61)
  Top 0.254: v115.56,17.62 v115.56,37.94 v115.56,46.83 | v92.7,35.4 v92.7,45.55
  Bottom 0.254: IC2.6 124.45,45.55 124.45,46.83 v115.56,46.83 | v115.56,17.62 100.33,17.62 D36L.28 | BUS1.13 100.33,48.09 95.25,48.09 v92.7,45.55 | v92.7,35.4 107.95,35.4 110.48,37.94 v115.56,37.94
BIOP2  (via drill 0.61)
  Top 0.254: IC3.6 123.19,54.45 v123.19,45.55 | D36L.30 101.59,23.96 104.14,26.51 v104.14,45.55
  Bottom 0.254: v123.19,45.55 114.3,45.55 113.03,44.29 113.03,40.48 109.22,40.48 v104.14,45.55 100.33,45.55 BUS1.14
BIOP4  (via drill 0.61)
  Top 0.254: IC4.6 123.19,67.14 123.19,59.52 120.65,56.98 120.65,39.2 123.19,36.66 123.19,20.16 115.56,12.54 107.95,12.54 107.95,15.08 104.14,15.08 D36L.32 | v106.68,68.41 v106.68,50.63
  Bottom 0.254: BUS1.15 105.41,49.37 v106.68,50.63 | v106.68,68.41 109.22,70.95 119.38,70.95 IC4.6
BMB00  (via drill 0.61)
  Top 0.254: v120.65,21.43 118.11,23.96 v118.11,48.09
  Bottom 0.254: D35L.2 132.08,21.43 v120.65,21.43 | v118.11,48.09 114.3,48.09 113.03,49.37 113.03,53.18 100.33,53.18 BUS1.18
BMB01  (via drill 0.61)
  Top 0.254: D35L.4 134.62,21.43 134.62,18.89 121.92,6.18 62.22,6.18 v62.22,25.23 | v66.04,29.05 66.04,48.09 v69.84,51.91 | v88.9,54.45 90.17,55.72 v90.17,60.8 | v96.52,55.72 v96.52,60.8
  Bottom 0.254: v66.04,29.05 v62.22,25.23 | v69.84,51.91 72.39,54.45 v88.9,54.45 | v96.52,60.8 v90.17,60.8 | v96.52,55.72 100.33,55.72 BUS1.19
BMB02  (via drill 0.61)
  Top 0.254: BUS1.20 97.79,55.72 v97.79,58.26 | v93.98,58.26 92.7,59.52 92.7,74.77 90.17,77.3 v90.17,79.84 | v99.06,90 v99.06,82.38 | v139.69,26.51 v139.69,83.65
  Bottom 0.254: v93.98,58.26 v97.79,58.26 | v90.17,79.84 92.7,82.38 v99.06,82.38 | v99.06,90 107.95,90 109.22,91.27 129.53,91.27 137.16,83.65 v139.69,83.65 | v139.69,26.51 137.16,23.96 134.62,23.96 D35L.6
BMB03  (via drill 0.61)
  Top 0.254: v114.3,30.32 IC1.3 | v104.14,54.45 104.14,46.83 102.87,45.55 v102.87,32.86
  Bottom 0.254: D35L.10 v114.3,30.32 105.41,30.32 v102.87,32.86 | v104.14,54.45 BUS1.21
BMB04  (via drill 0.61)
  Top 0.254: v93.98,54.45 v93.98,56.98 | v105.41,46.83 v105.41,50.63 | v113.03,45.55 113.03,26.51 IC1.2
  Bottom 0.254: IC1.2 114.3,27.78 130.81,27.78 132.08,29.05 134.62,29.05 134.62,35.4 D35L.14 | v93.98,56.98 BUS1.22 | v93.98,54.45 97.79,50.63 v105.41,50.63 | v105.41,46.83 106.68,45.55 v113.03,45.55
BMB05  (via drill 0.61)
  Top 0.254: BUS1.23 100.33,58.26 v100.33,43.02
  Bottom 0.254: IC1.1 111.76,22.7 128.27,22.7 132.08,26.51 137.16,26.51 137.16,39.2 134.62,39.2 | D35L.18 134.62,39.2 | v100.33,43.02 104.14,43.02 107.95,39.2 134.62,39.2
BMB06
  Top 0.254: IC2.3 114.3,48.09 115.56,49.37 115.56,54.45 | IC3.3 115.56,54.45 | IC4.3 115.56,67.14 115.56,54.45
  Bottom 0.254: BUS1.24 100.33,58.26 111.76,58.26 | IC3.3 111.76,58.26 | D35L.24 134.62,49.37 134.62,56.98 128.27,56.98 127,58.26 111.76,58.26
BMB07  (via drill 0.61)
  Top 0.254: IC2.2 111.76,48.09 113.03,49.37 113.03,54.45 | IC3.2 113.03,54.45 | IC4.2 113.03,67.14 v113.03,60.8 113.03,54.45
  Bottom 0.254: BUS1.25 107.95,62.06 109.22,60.8 v113.03,60.8 | D35L.28 114.3,53.18 IC3.2
BMB08  (via drill 0.61)
  Top 0.254: IC2.1 110.48,44.29 110.48,54.45 | IC3.1 110.48,54.45 | IC4.1 110.48,67.14 v110.48,59.52 110.48,54.45
  Bottom 0.254: BUS1.26 100.33,60.8 107.95,60.8 109.22,59.52 v110.48,59.52 132.08,59.52 D35L.32
BMB09  (via drill 0.61)
  Top 0.254: v129.53,60.8 128.27,59.52 v128.27,29.05 | v91.44,43.02 v91.44,40.48 | v95.25,46.83 95.25,60.8 97.79,63.34 101.59,63.34 BUS1.27
  Bottom 0.254: v129.53,60.8 D35L.34 | v128.27,29.05 95.25,29.05 91.44,32.86 88.9,32.86 87.62,34.12 87.62,35.4 88.9,35.4 90.17,36.66 90.17,40.48 v91.44,40.48 | v95.25,46.83 v91.44,43.02
BMB10
  Bottom 0.254: BUS1.28 100.33,65.88 129.53,65.88 132.08,63.34 D35L.36
BMB11
  Bottom 0.254: BUS1.29 107.95,73.49 125.73,73.49 D35L.38
BTS3  (via drill 0.61)
  Top 0.254: v64.77,44.29 64.77,16.35 63.49,15.08 63.49,12.54 66.04,10 102.87,10 102.87,17.62 106.68,17.62 D36L.34
  Bottom 0.254: BUS1.16 95.25,49.37 92.7,46.83 80.01,46.83 77.47,44.29 v64.77,44.29
DA00  (via drill 0.61)
  Top 0.254: v15.23,87.46 C36L.2
  Bottom 0.254: v15.23,87.46 31.75,87.46 BUS2.5
DA01  (via drill 0.61)
  Top 0.254: v31.75,92.54 33.02,91.27 BUS2.6
  Bottom 0.254: C36L.4 10.15,83.65 3.81,90 3.81,92.54 v31.75,92.54
DA02  (via drill 0.61)
  Top 0.254: v34.28,81.11 34.28,83.65 35.55,84.92 BUS2.7
  Bottom 0.254: C36L.6 13.96,78.57 19.05,78.57 19.05,81.11 v34.28,81.11
DA03
  Bottom 0.254: C36L.8 5.08,90 5.08,91.27 30.48,91.27 31.75,90 34.28,90 BUS2.8
DA04
  Bottom 0.254: C36L.10 17.78,84.92 34.28,84.92 34.28,87.46 36.82,87.46 BUS2.9
DA05  (via drill 0.61)
  Top 0.254: v34.28,78.57 36.82,78.57 36.82,87.46 BUS2.10
  Bottom 0.254: C36L.12 21.59,78.57 v34.28,78.57
DA06  (via drill 0.61)
  Top 0.254: C36L.14 24.12,81.11 v24.12,82.38
  Bottom 0.254: v24.12,82.38 25.39,83.65 34.28,83.65 35.55,84.92 39.36,84.92 BUS2.11
DA07
  Top 0.254: C36L.16 25.39,88.73 31.75,95.08 40.63,95.08 BUS2.12
DA08  (via drill 0.61)
  Top 0.254: C36L.18 29.21,78.57 v29.21,76.03 | v41.9,76.03 41.9,83.65 43.17,84.92 BUS2.13
  Bottom 0.254: v41.9,76.03 v29.21,76.03
DA09  (via drill 0.61)
  Top 0.254: C36L.22 33.02,83.65 34.28,84.92 34.28,90 v39.36,90
  Bottom 0.254: v39.36,90 41.9,90 BUS2.14
DA10  (via drill 0.61)
  Top 0.254: v35.55,83.65 C36L.24
  Bottom 0.254: v35.55,83.65 40.63,83.65 41.9,84.92 44.45,84.92 BUS2.15
DA11  (via drill 0.61)
  Top 0.254: C36L.26 39.36,79.84 v39.36,87.46
  Bottom 0.254: v39.36,87.46 44.45,87.46 BUS2.16
DATA00  (via drill 0.61)
  Top 0.254: v31.75,91.27 v31.75,82.38
  Bottom 0.254: C35L.2 36.82,82.38 v31.75,82.38 | v31.75,91.27 50.79,91.27 52.06,90 52.06,86.19 BUS2.21
DATA01  (via drill 0.61)
  Top 0.254: C35L.4 40.63,83.65 41.9,84.92 v41.9,92.54
  Bottom 0.254: v41.9,92.54 53.34,92.54 54.6,91.27 54.6,88.73 BUS2.22
DATA02
  Bottom 0.254: C35L.6 44.45,81.11 44.45,76.03 52.06,76.03 52.06,83.65 54.6,83.65 55.88,84.92 BUS2.23
DATA03  (via drill 0.61)
  Top 0.254: v49.52,87.46 49.52,90 52.06,92.54 55.88,92.54 BUS2.24
  Bottom 0.254: C35L.8 49.52,84.92 v49.52,87.46
DATA04
  Bottom 0.254: C35L.10 52.06,84.92 54.6,84.92 54.6,87.46 57.14,87.46 BUS2.25
DATA05
  Top 0.254: C35L.12 54.6,84.92 57.14,84.92 57.14,87.46 BUS2.26
DATA06
  Bottom 0.254: C35L.14 57.14,84.92 59.68,84.92 BUS2.27
DATA07
  Bottom 0.254: C35L.16 57.14,82.38 59.68,82.38 62.22,84.92 62.22,88.73 BUS2.28
DATA08
  Top 0.254: C35L.18 59.68,79.84 64.77,79.84 64.77,84.92 BUS2.29
DATA09
  Top 0.254: C35L.22 62.22,82.38 62.22,87.46 BUS2.30
DATA10
  Top 0.254: BUS2.31 C35L.24
DATA11
  Top 0.254: C35L.26 67.31,82.38 67.31,87.46 BUS2.32
DATA_IN
  Top 0.254: C36L.30 44.45,79.84 44.45,82.38 46.98,84.92 46.98,87.46 BUS2.18
DMA00  (via drill 0.61)
  Top 0.254: DMA0-3.7 87.62,31.59 v87.62,41.74 | v91.44,45.55 91.44,48.09 92.7,49.37 v92.7,54.45
  Bottom 0.254: v91.44,45.55 v87.62,41.74 | v92.7,54.45 90.17,56.98 90.17,59.52 IC8.8
DMA01
  Top 0.254: DMA0-3.6 86.36,32.86 82.55,36.66 82.55,62.06 IC8.6
DMA02
  Top 0.254: DMA0-3.2 77.47,31.59 77.47,60.8 76.2,62.06 IC8.4
DMA03  (via drill 0.61)
  Top 0.254: v71.12,34.12 IC8.2 | DMA0-3.3 v78.73,34.12
  Bottom 0.254: v78.73,34.12 v71.12,34.12
DMA04  (via drill 0.61)
  Top 0.254: v58.41,36.66 DMA4-7.7 | v62.22,36.66 63.49,37.94 63.49,53.18 64.77,54.45 v64.77,56.98
  Bottom 0.254: v62.22,36.66 v58.41,36.66 | v64.77,56.98 60.95,60.8 58.41,60.8 IC7.8
DMA05
  Top 0.254: DMA4-7.6 57.14,34.12 57.14,44.29 52.06,49.37 52.06,62.06 IC7.6
DMA06
  Top 0.254: DMA4-7.2 45.71,37.94 44.45,39.2 44.45,60.8 45.71,62.06 IC7.4
DMA07  (via drill 0.61)
  Top 0.254: v35.55,35.4 35.55,70.95 38.09,73.49 39.36,73.49 39.36,64.6 IC7.2
  Bottom 0.254: DMA4-7.3 45.71,35.4 v35.55,35.4
DMA08  (via drill 0.61)
  Top 0.254: DMA8-11.7 27.94,32.86 31.75,29.05 33.02,29.05 33.02,70.95 30.48,73.49 29.21,73.49 v29.21,67.14 | v24.12,67.14 25.39,65.88 IC6.8
  Bottom 0.254: v24.12,67.14 v29.21,67.14
DMA09
  Top 0.254: DMA8-11.6 21.59,41.74 21.59,62.06 IC6.6
DMA10
  Top 0.254: DMA8-11.2 13.96,39.2 13.96,62.06 IC6.4
DMA11
  Top 0.254: DMA8-11.3 15.23,35.4 10.15,35.4 IC6.2
EA1  (via drill 0.61)
  Top 0.254: v78.73,46.83 EMA4-1.3 | v67.31,74.77 v67.31,51.91 | v90.17,76.03 91.44,74.77 IC8.11
  Bottom 0.254: v78.73,46.83 72.39,46.83 v67.31,51.91 | v67.31,74.77 68.58,76.03 v90.17,76.03
EA2  (via drill 0.61)
  Top 0.254: v83.81,53.18 87.62,56.98 87.62,69.68 IC8.13
  Bottom 0.254: EMA4-1.2 78.73,53.18 v83.81,53.18
EA3  (via drill 0.61)
  Top 0.254: v83.81,60.8 85.09,62.06 85.09,72.22 83.81,73.49 81.28,73.49 IC8.15
  Bottom 0.254: EMA4-1.6 83.81,48.09 72.39,48.09 68.58,51.91 68.58,60.8 v83.81,60.8
EMA04  (via drill 0.61)
  Top 0.254: v40.63,46.83 40.63,58.26 44.45,62.06 44.45,69.68 IC7.17
  Bottom 0.254: EMA4-7.7 54.6,46.83 v40.63,46.83
EMA05
  Top 0.254: EMA4-7.6 54.6,51.91 54.6,72.22 53.34,73.49 50.79,73.49 IC7.15
EMA06  (via drill 0.61)
  Top 0.254: v55.88,53.18 57.14,54.45 57.14,67.14 55.88,68.41 IC7.13
  Bottom 0.254: EMA4-7.2 48.25,53.18 v55.88,53.18
EMA07  (via drill 0.61)
  Top 0.254: v48.25,54.45 EMA4-7.3 | v63.49,54.45 63.49,68.41 IC7.11
  Bottom 0.254: v63.49,54.45 v48.25,54.45
EMA08  (via drill 0.61)
  Top 0.254: v17.78,55.72 16.51,56.98 16.51,68.41 15.23,69.68 IC6.17
  Bottom 0.254: EMA8-11.7 24.12,55.72 v17.78,55.72
EMA09
  Top 0.254: EMA8-11.6 24.12,53.18 24.12,65.88 20.32,69.68 IC6.15
EMA10  (via drill 0.61)
  Top 0.254: v25.39,56.98 26.67,58.26 26.67,65.88 25.39,67.14 IC6.13
  Bottom 0.254: EMA8-11.2 15.23,56.98 v25.39,56.98
EMA11  (via drill 0.61)
  Top 0.254: v31.75,56.98 31.75,69.68 IC6.11
  Bottom 0.254: EMA8-11.3 20.32,49.37 27.94,49.37 29.21,50.63 29.21,56.98 v31.75,56.98
GND  (via drill 0.61)
  Top 0.254: D34L.7 D34L.9 D34L.11 | D34L.13 D34L.15 D34L.17 | D34L.37 D34L.35 | IC5.7 127,83.65 D34L.25 D34L.23 | D35L.1 D35L.3 D35L.5 D35L.7 D35L.9 D35L.11 D35L.13 D35L.15 D35L.17 D35L.19 D35L.21 D35L.23 D35L.25 D35L.27 D35L.29 D35L.31 D35L.33 D35L.35 D35L.37 D35L.39 134.62,69.68 D34L.31 | IC3.5 119.38,60.8 120.65,62.06 120.65,67.14 IC4.5 121.92,70.95 127,70.95 IC4.8 125.73,67.14 125.73,54.45 | IC1.8 125.73,26.51 125.73,41.74 | IC2.8 125.73,41.74 | 125.73,54.45 IC3.8 | 125.73,41.74 125.73,54.45 | D36L.35 D36L.37 D36L.39 116.84,16.35 IC1.4 | D36L.33 D36L.31 | D36L.1 D36L.3 D36L.5 D36L.7 D36L.9 D36L.11 D36L.13 D36L.15 D36L.17 D36L.19 90.17,13.81 | 90.17,13.81 D36L.21 D36L.23 D36L.25 D36L.27 | 90.17,29.05 DMA0-3.8 | 90.17,13.81 90.17,29.05 | 90.17,29.05 90.17,49.37 EMA4-1.8 EMA4-1.9 IC8.10 90.17,64.6 90.17,74.77 C35L.39 C35L.37 C35L.35 C35L.33 C35L.31 74.93,78.57 | DMA4-7.8 60.95,37.94 59.68,39.2 59.68,48.09 60.95,49.37 EMA4-7.8 60.95,54.45 59.68,55.72 59.68,62.06 IC7.10 | C35L.17 C35L.19 C35L.21 C35L.23 | C35L.23 C35L.25 C35L.27 | BUS2.38 BUS2.40 BUS2.39 74.93,84.92 74.93,78.57 | 74.93,78.57 C35L.29 | v64.77,64.6 66.04,65.88 C35L.23 | C36L.1 C36L.3 C36L.5 | C36L.7 C36L.9 C36L.11 C36L.13 C36L.15 | C35L.3 C36L.27 C36L.25 | C35L.1 C36L.25 | C36L.19 C36L.21 34.28,77.3 | 34.28,77.3 C36L.23 C36L.25 | C35L.15 C36L.39 C36L.37 | C35L.13 C36L.37 | C35L.11 C36L.35 | C35L.9 C36L.33 | C35L.5 C36L.29 C36L.31 | C35L.7 C36L.31 | C36L.31 C36L.33 | C36L.33 C36L.35 | C36L.35 C36L.37 | 34.28,77.3 v34.28,64.6 v34.28,39.2 | v96.52,90 D34L.1
  Bottom 0.254: D34L.1 D34L.3 D34L.5 D34L.7 | D34L.17 D34L.19 D34L.21 D34L.23 | D34L.37 D34L.39 | D34L.25 D34L.27 D34L.29 D34L.31 D34L.33 D34L.35 | D34L.13 D34L.11 | IC2.5 121.92,40.48 124.45,40.48 125.73,41.74 | IC2.8 125.73,41.74 | D35L.17 134.62,41.74 125.73,41.74 | IC1.5 IC1.4 | DMA0-3.4 83.81,27.78 88.9,27.78 DMA0-3.8 | D36L.27 D36L.29 D36L.31 | D36L.33 D36L.35 | C35L.29 C35L.27 | IC7.10 62.22,64.6 v64.77,64.6 | DMA8-11.4 22.86,35.4 27.94,35.4 29.21,36.66 | DMA8-11.8 29.21,36.66 | DMA4-7.4 46.98,36.66 34.28,36.66 | 29.21,36.66 34.28,36.66 | C36L.15 C36L.17 C36L.19 | C36L.7 C36L.5 | EMA8-11.8 34.28,55.72 34.28,63.34 | IC6.10 34.28,63.34 | C36L.29 C36L.27 | v34.28,64.6 34.28,63.34 | v34.28,39.2 34.28,36.66 | C35L.15 C35L.17 | v96.52,90 95.25,88.73 BUS2.40
N$1
  Top 0.254: PAD6.1 IC1.9
N$3  (via drill 0.61)
  Top 0.254: v67.31,37.94 69.84,35.4 v69.84,21.43 | DMA0-3.5 v83.81,21.43
  Bottom 0.254: DMA4-7.12 55.88,37.94 v67.31,37.94 | v83.81,21.43 v69.84,21.43
N$5
  Top 0.254: PAD0.1 IC1.15
N$6
  Top 0.254: PAD1.1 IC1.14
N$7
  Top 0.254: PAD2.1 IC1.13
N$8
  Top 0.254: PAD3.1 IC1.12
N$9
  Top 0.254: PAD4.1 IC1.11
N$10
  Top 0.254: PAD5.1 IC1.10
N$11
  Top 0.254: IC1.7 127,22.7 129.53,22.7 PAD7.1
N$12  (via drill 0.61)
  Top 0.254: v74.93,55.72 74.93,64.6 76.2,65.88 IC8.17
  Bottom 0.254: EMA4-1.7 88.9,53.18 90.17,54.45 90.17,55.72 v74.93,55.72
N$13
  Bottom 0.254: DMA8-11.12 27.94,40.48 40.63,40.48 43.17,37.94 48.25,37.94 DMA4-7.5
N$16
  Bottom 0.254: IC6.19 12.69,68.41 38.09,68.41 | IC7.19 38.09,68.41 | IC8.19 68.58,68.41 38.09,68.41
N$22  (via drill 0.61)
  Top 0.254: v46.98,48.09 48.25,46.83 DMA4-7.14 48.25,39.2 49.52,37.94 49.52,15.08 v54.6,10 | v78.73,43.02 DMA0-3.14
  Bottom 0.254: DMA8-11.14 20.32,48.09 38.09,48.09 | v46.98,48.09 38.09,48.09 | v78.73,43.02 62.22,43.02 59.68,45.55 40.63,45.55 38.09,48.09 | IC5.6 124.45,83.65 129.53,83.65 140.97,72.22 140.97,10 v54.6,10
VCC  (via drill 0.61)
  Top 0.254: IC1.16 109.22,40.48 107.95,41.74 107.95,49.37 | IC2.16 107.95,49.37 | 107.95,62.06 IC3.16 | 107.95,49.37 107.95,62.06 | IC1.6 120.65,26.51 v120.65,36.66 | 107.95,74.77 IC4.16 | 107.95,62.06 107.95,74.77 | IC5.14 107.95,87.46 107.95,74.77 | DMA0-3.16 72.39,39.2 72.39,56.98 | EMA4-1.16 72.39,56.98 | 72.39,67.14 IC8.20 | 72.39,56.98 72.39,67.14 | DMA4-7.16 43.17,35.4 44.45,34.12 44.45,31.59 43.17,30.32 40.63,30.32 40.63,45.55 | 40.63,45.55 41.9,46.83 41.9,56.98 EMA4-7.16 | IC6.20 11.42,67.14 11.42,60.8 EMA8-11.16 | 40.63,45.55 36.82,49.37 36.82,69.68 IC7.20 | 72.39,67.14 v72.39,87.46
  Bottom 0.254: v120.65,36.66 110.48,36.66 109.22,35.4 IC1.16 | DMA8-11.16 12.69,49.37 11.42,50.63 11.42,59.52 EMA8-11.16 | 35.55,73.49 IC7.20 | 35.55,73.49 10.15,73.49 IC6.20 | IC8.20 66.04,73.49 35.55,73.49 | IC5.14 107.95,87.46 v72.39,87.46